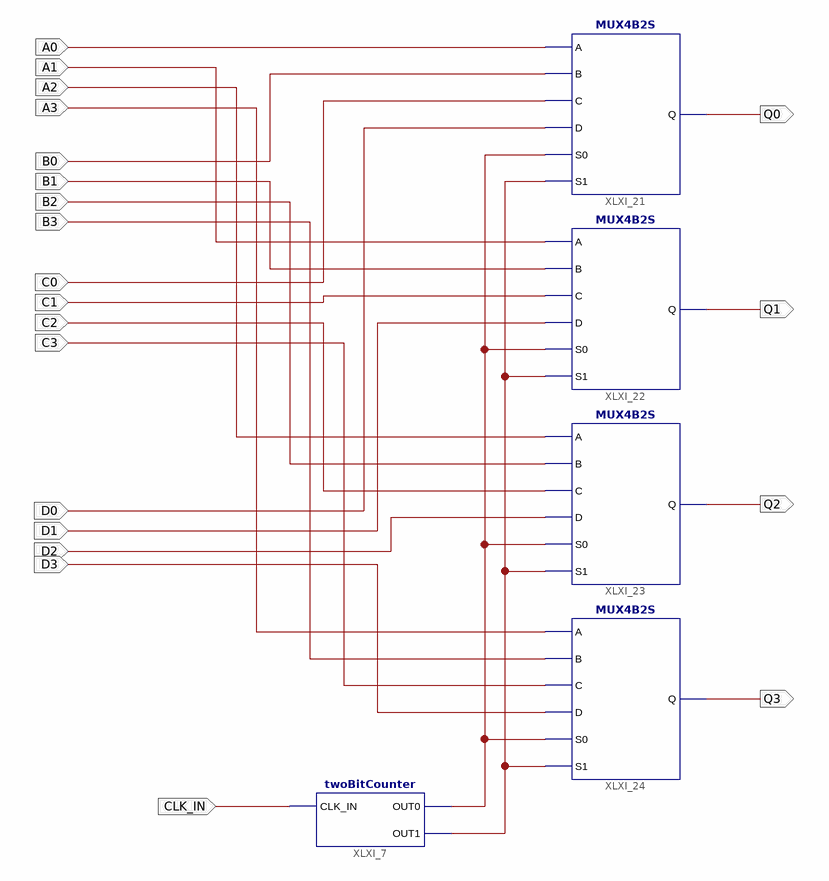
[diagram p0: schematic sheet 1]
// Xilinx ISE schematic MUX16_4.sch (spartan6) as structural Verilog: 5 symbols, 21 ports
module MUX16_4 (
  input  CLK_IN,
  input  A0,
  input  A1,
  input  A2,
  input  A3,
  input  B0,
  input  B1,
  input  B2,
  input  B3,
  input  C0,
  input  C1,
  input  C2,
  input  C3,
  input  D0,
  input  D1,
  input  D2,
  input  D3,
  output Q0,
  output Q1,
  output Q2,
  output Q3
);

  wire XLXN_23, XLXN_24;

  MUX4B2S XLXI_21 (.A(A0), .B(B0), .C(C0), .D(D0), .S0(XLXN_23), .S1(XLXN_24), .Q(Q0));
  MUX4B2S XLXI_22 (.A(A1), .B(B1), .C(C1), .D(D1), .S0(XLXN_23), .S1(XLXN_24), .Q(Q1));
  MUX4B2S XLXI_23 (.A(A2), .B(B2), .C(C2), .D(D2), .S0(XLXN_23), .S1(XLXN_24), .Q(Q2));
  MUX4B2S XLXI_24 (.A(A3), .B(B3), .C(C3), .D(D3), .S0(XLXN_23), .S1(XLXN_24), .Q(Q3));
  twoBitCounter XLXI_7 (.CLK_IN(CLK_IN), .OUT0(XLXN_23), .OUT1(XLXN_24));
endmodule
